# EAGLE schematic tapometer (EAGLE 6.2)
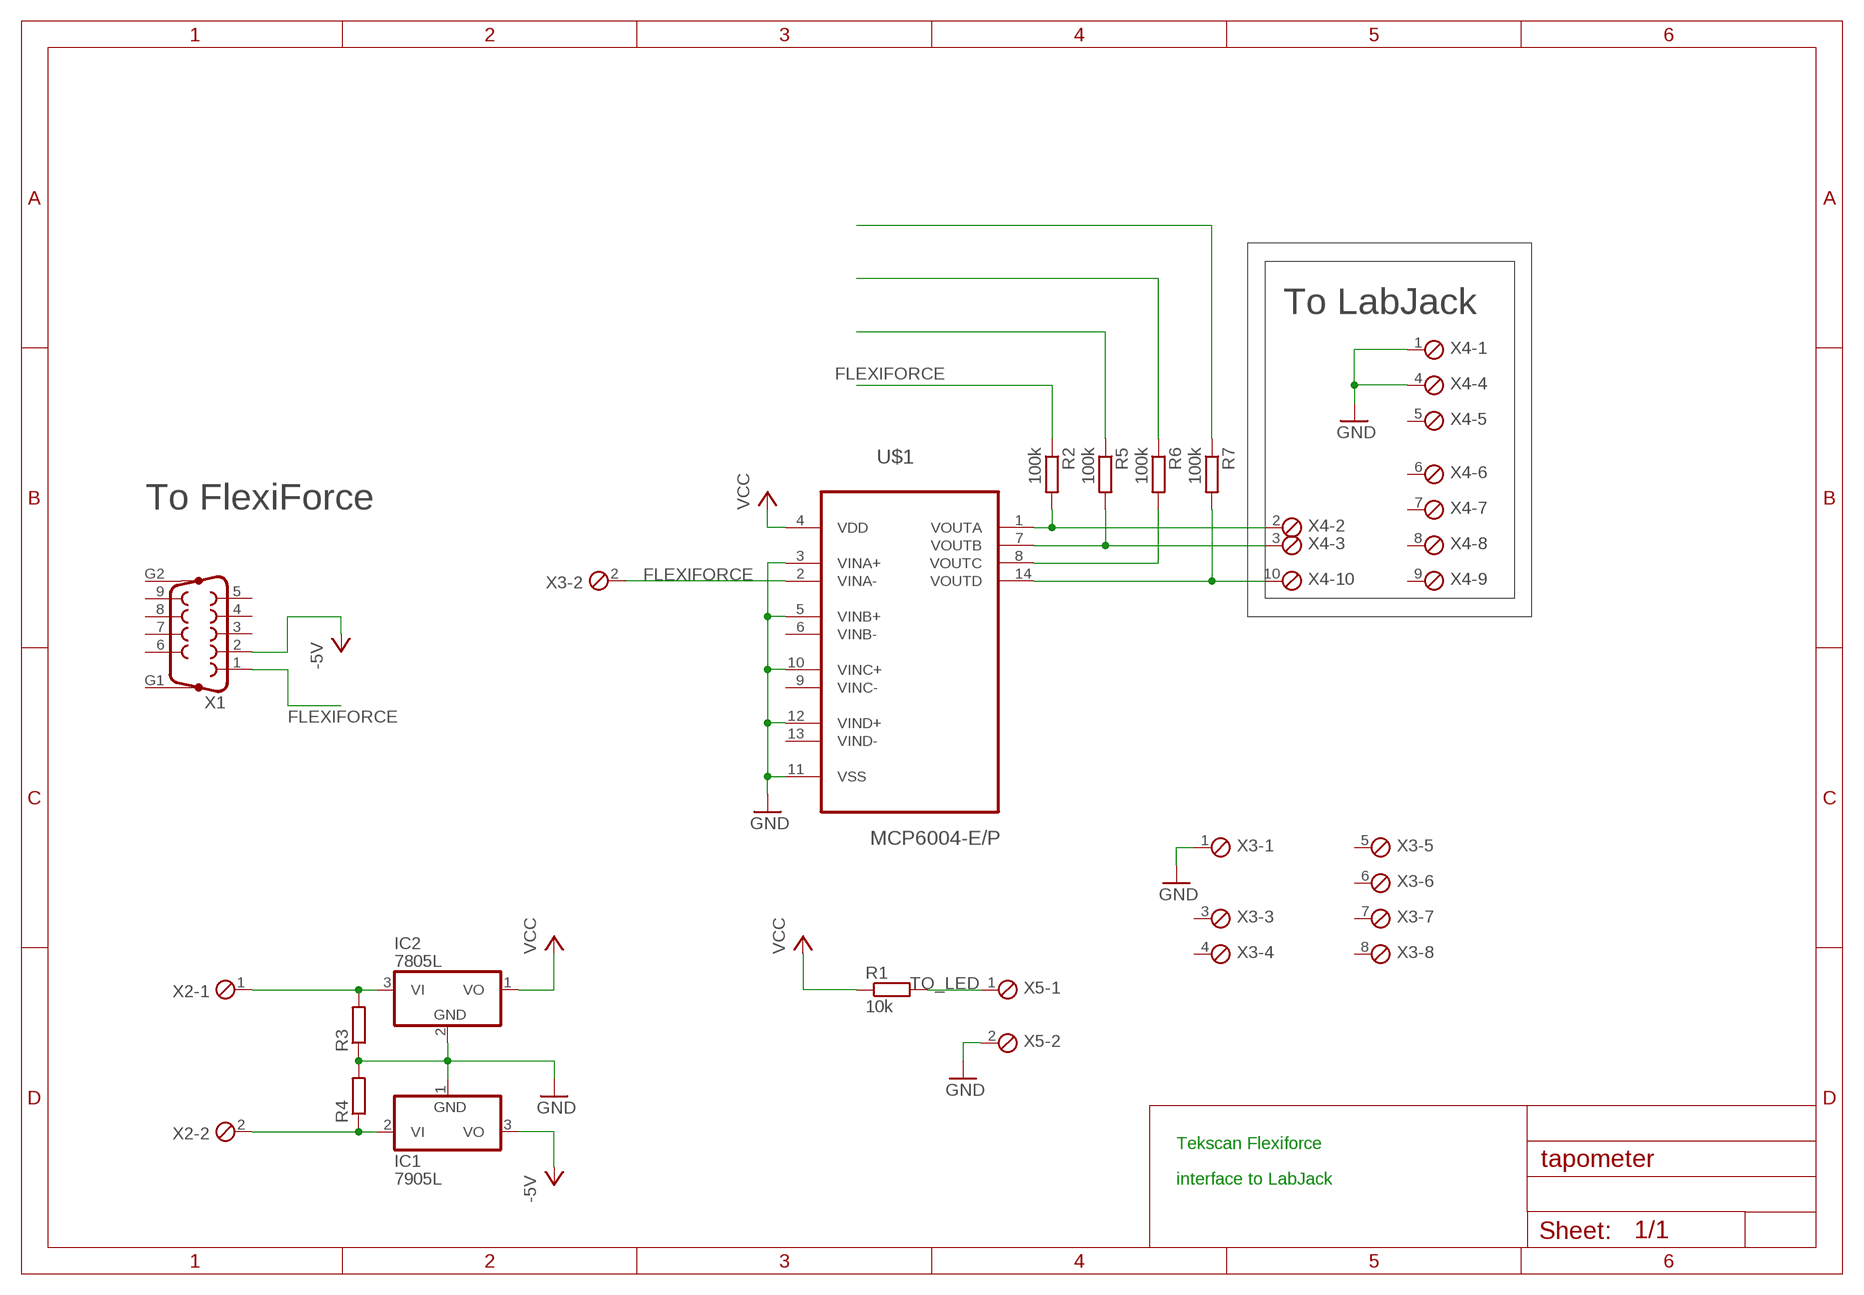
[diagram p0: schematic, sheet 1]

## Parts
IC1  7905L  [TO92]
IC2  7805L  [TO92]
R1  10k  R-EU_0207/10  [0207/10]
R2  100k  R-EU_0207/10  [0207/10]
R3  R-EU_0207/10  [0207/10]
R4  R-EU_0207/10  [0207/10]
R5  100k  R-EU_0207/10  [0207/10]
R6  100k  R-EU_0207/10  [0207/10]
R7  100k  R-EU_0207/10  [0207/10]
U$1  MCP6004-E/P  [DIP254P762X533-14]
X1  F09HP  [F09HP]
X2  MPT2  [2POL254]
X3  MPT8  [8POL254]
X4  MPT10  [10POL254]
X5  MPT2  [2POL254]

## Nets
-5V: IC1.3(VO) X1.2
FLEXIFORCE: R2.1 U$1.2(VINA-) X1.1 X3.2
GND: IC1.1(GND) IC2.2(GND) R3.1 R4.2 U$1.3(VINA+) U$1.5(VINB+) U$1.10(VINC+) U$1.11(VSS) U$1.12(VIND+) X3.1 X4.1 X4.4 X5.2
N$1: R5.2 U$1.7(VOUTB) X4.3
N$2: R2.2 U$1.1(VOUTA) X4.2
N$3: R7.2 U$1.14(VOUTD) X4.10
N$4: IC2.3(VI) R3.2 X2.1
N$5: IC1.2(VI) R4.1 X2.2
N$6: R6.2 U$1.8(VOUTC)
N$7: R5.1
N$8: R6.1
N$9: R7.1
TO_LED: R1.2 X5.1
VCC: IC2.1(VO) R1.1 U$1.4(VDD)
Unconnected: U$1.6(VINB-) U$1.9(VINC-) U$1.13(VIND-) X1.3 X1.4 X1.5 X1.6 X1.7 X1.8 X1.9 X1.G1 X1.G2 X3.3 X3.4 X3.5 X3.6 X3.7 X3.8 X4.5 X4.6 X4.7 X4.8 X4.9

## Notes on the sheet
- To LabJack
- To FlexiForce
- Tekscan Flexiforce
- interface to LabJack

## Library data of the parts
IC1 = linear:79*: Negative VOLTAGE REGULATOR
IC2 = linear:78*: Positive VOLTAGE REGULATOR Source: http://cache.national.com/ds/LM/LM78L05.pdf http://www.fairchildsemi.com/ds/LM/LM7805.pdf
R1-R7 = rcl:R-EU_: RESISTOR, European symbol
U$1 = microchip6004:MCP6004-E/P: 1 MHz, Low-Power Op Amp; MPN: MCP6004-E/P; OC_FARNELL: 1332121; OC_NEWARK: 34M7474; PACKAGE: DIP-14; SUPPLIER: Microchip
X1 = con-subd:F09HP: SUB-D; OC_FARNELL: unknown; OC_NEWARK: unknown
X2 X5 = con-phoenix-254:MPT2: PHOENIX CONNECTOR; OC_FARNELL: unknown; OC_NEWARK: unknown
X3 = con-phoenix-254:MPT8: PHOENIX CONNECTOR; OC_FARNELL: unknown; OC_NEWARK: unknown
X4 = con-phoenix-254:MPT10: PHOENIX CONNECTOR; OC_FARNELL: unknown; OC_NEWARK: unknown